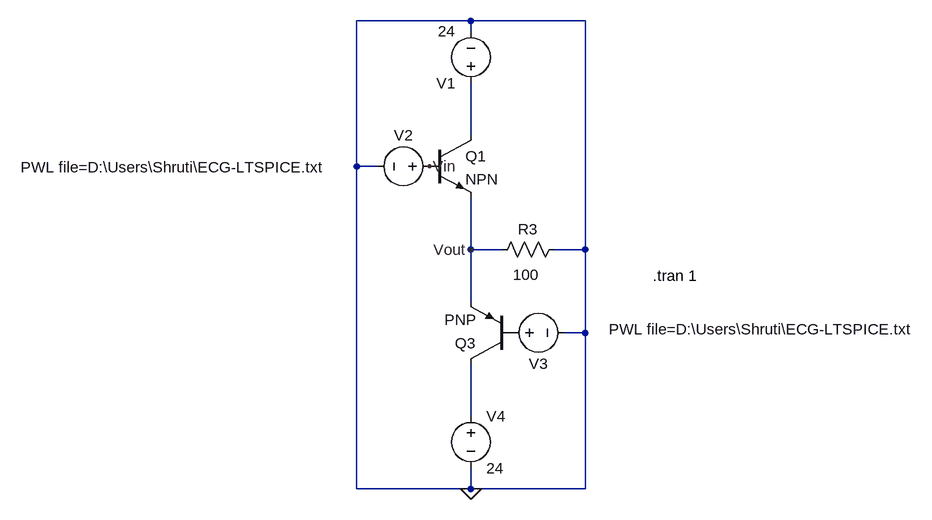
[diagram p0: schematic push pull with ECG.asc]
push pull with ECG.asc, the LTspice schematic file:
Version 4
SHEET 1 1092 680
WIRE 208 -64 32 -64
WIRE 384 -64 208 -64
WIRE 208 -48 208 -64
WIRE 208 112 208 32
WIRE 32 160 32 -64
WIRE 64 160 32 160
WIRE 208 288 208 208
WIRE 256 288 208 288
WIRE 384 288 384 -64
WIRE 384 288 336 288
WIRE 208 368 208 288
WIRE 384 416 384 288
WIRE 384 416 352 416
WIRE 208 544 208 464
WIRE 32 656 32 160
WIRE 208 656 208 624
WIRE 208 656 32 656
WIRE 384 656 384 416
WIRE 384 656 208 656
FLAG 208 656 0
FLAG 144 160 Vin
FLAG 208 288 Vout
SYMBOL npn 144 112 R0
SYMATTR InstName Q1
SYMBOL voltage 208 48 R180
WINDOW 123 0 0 Left 0
WINDOW 39 0 0 Left 0
SYMATTR InstName V1
SYMATTR Value 24
SYMBOL voltage 160 160 R90
WINDOW 0 -32 56 VBottom 2
WINDOW 3 -14 412 VTop 2
WINDOW 123 0 0 Left 0
WINDOW 39 0 0 Left 0
SYMATTR InstName V2
SYMATTR Value PWL file=D:\Users\Shruti\ECG-LTSPICE.txt
SYMBOL res 352 272 R90
WINDOW 0 0 56 VBottom 2
WINDOW 3 39 59 VTop 2
SYMATTR InstName R3
SYMATTR Value 100
SYMBOL voltage 256 416 R270
WINDOW 0 -32 56 VBottom 2
WINDOW 3 -10 397 VTop 2
WINDOW 123 0 0 Left 0
WINDOW 39 0 0 Left 0
SYMATTR InstName V3
SYMATTR Value PWL file=D:\Users\Shruti\ECG-LTSPICE.txt
SYMBOL voltage 208 528 R0
WINDOW 123 0 0 Left 0
WINDOW 39 0 0 Left 0
SYMATTR InstName V4
SYMATTR Value 24
SYMBOL pnp 272 464 R180
SYMATTR InstName Q3
TEXT 488 328 Left 2 !.tran 1

The netlist it stands for:
* push pull with ECG.asc
Q1 N001 Vin Vout 0 NPN
V1 N001 0 24
V2 Vin 0 PWL file=D:\Users\Shruti\ECG-LTSPICE.txt
R3 0 Vout 100
V3 P001 0 PWL file=D:\Users\Shruti\ECG-LTSPICE.txt
V4 N002 0 24
Q3 N002 P001 Vout 0 PNP
.model NPN NPN
.model PNP PNP
.lib standard.bjt
.tran 1
.backanno
.end